# EAGLE design iot-plant-waterer (EAGLE 9.6.2)
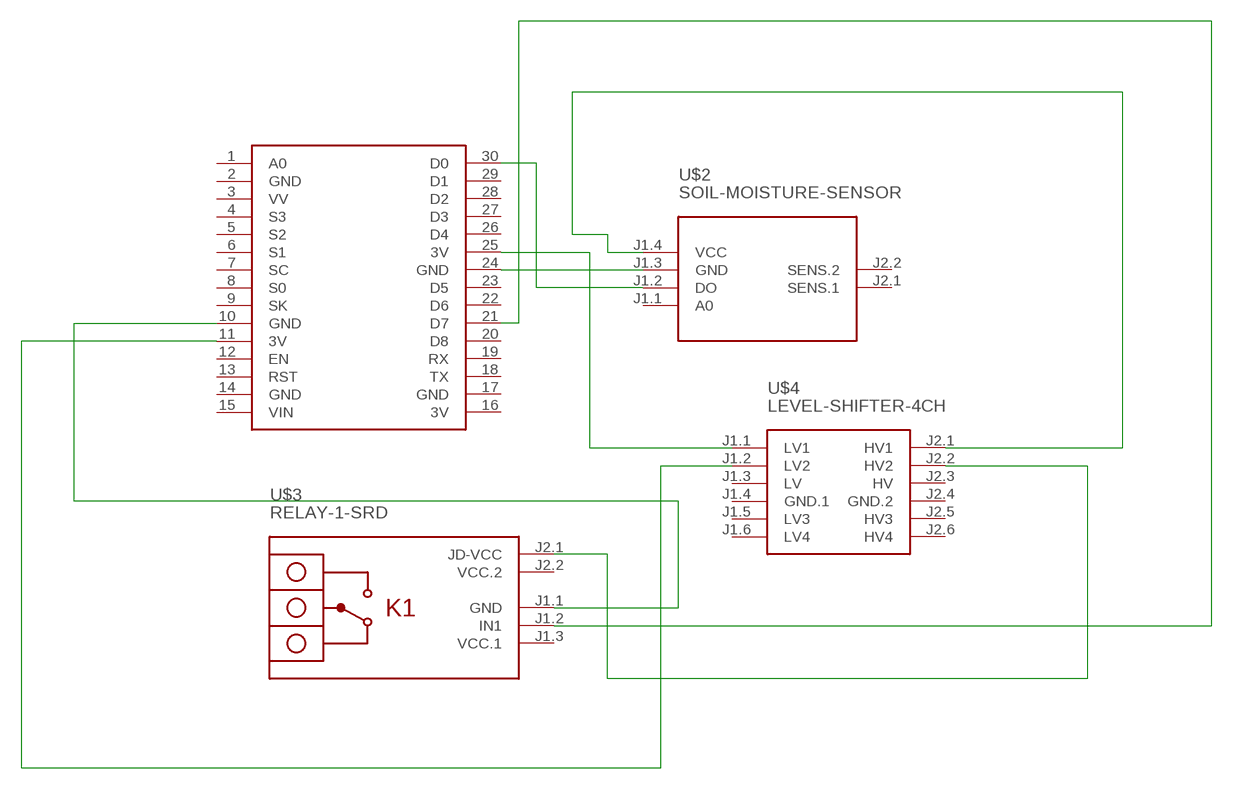
[diagram p0: schematic, sheet 1]

## Parts
U$1  NODEMCU  [NODEMCU]
U$2  SOIL-MOISTURE-SENSOR  [SOIL-MOISTURE-SENSOR]
U$3  RELAY-1-SRD  [RELAY-1-SRD]
U$4  LEVEL-SHIFTER-4CH  [LEVEL-SHIFTER-4CH]

## Nets
N$1: U$1.25(3V) U$4.J1.1(LV1)
N$2: U$2.J1.4(VCC) U$4.J2.1(HV1)
N$3: U$1.24(GND) U$2.J1.3(GND)
N$4: U$1.30(D0) U$2.J1.2(DO)
N$5: U$1.11(3V) U$4.J1.2(LV2)
N$6: U$3.J2.1(JD-VCC) U$4.J2.2(HV2)
N$7: U$1.10(GND) U$3.J1.1(GND)
N$8: U$1.21(D7) U$3.J1.2(IN1)
Unconnected: U$1.1(A0) U$1.3(VV) U$1.4(S3) U$1.5(S2) U$1.6(S1) U$1.7(SC) U$1.8(S0) U$1.9(SK) U$1.12(EN) U$1.13(RST) U$1.15(VIN) U$1.18(TX) U$1.19(RX) U$1.20(D8) U$1.22(D6) U$1.23(D5) U$1.26(D4) U$1.27(D3) U$1.28(D2) U$1.29(D1) U$2.J1.1(A0) U$2.J2.1(SENS.1) U$2.J2.2(SENS.2) U$4.J1.5(LV3) U$4.J1.6(LV4) U$4.J2.5(HV3) U$4.J2.6(HV4)

## Power pins joined to a net without a drawn wire
3V: U$1.16(3V)
GND: U$1.2(GND) U$1.14(GND) U$1.17(GND)
GND.1: U$4.J1.4(GND.1)
GND.2: U$4.J2.4(GND.2)
HV: U$4.J2.3(HV)
LV: U$4.J1.3(LV)
VCC.1: U$3.J1.3(VCC.1)
VCC.2: U$3.J2.2(VCC.2)

## Library data of the parts
U$1 = nodemcu:NODEMCU
U$2 = diy-modules:SOIL-MOISTURE-SENSOR: Soil Moisture Sensor Click here to find device on ebay.com <http://www.ebay.com/sch/soil+moisture+sensor+arduino>
U$3 = diy-modules:RELAY-1-SRD: 1-Channel Relay Module based on SRD-05VDC-SL-C relays Click here to find device on ebay.com <http://www.ebay.com/sch/one+channel+isolated+relay+5v>
U$4 = diy-modules:LEVEL-SHIFTER-4CH: 4-Channel Bi-Directional Logic Level Converter based on BSS128 transistors Click here to find device on ebay.com <http://www.ebay.com/sch/i2c+logic+converter+module>

## Board
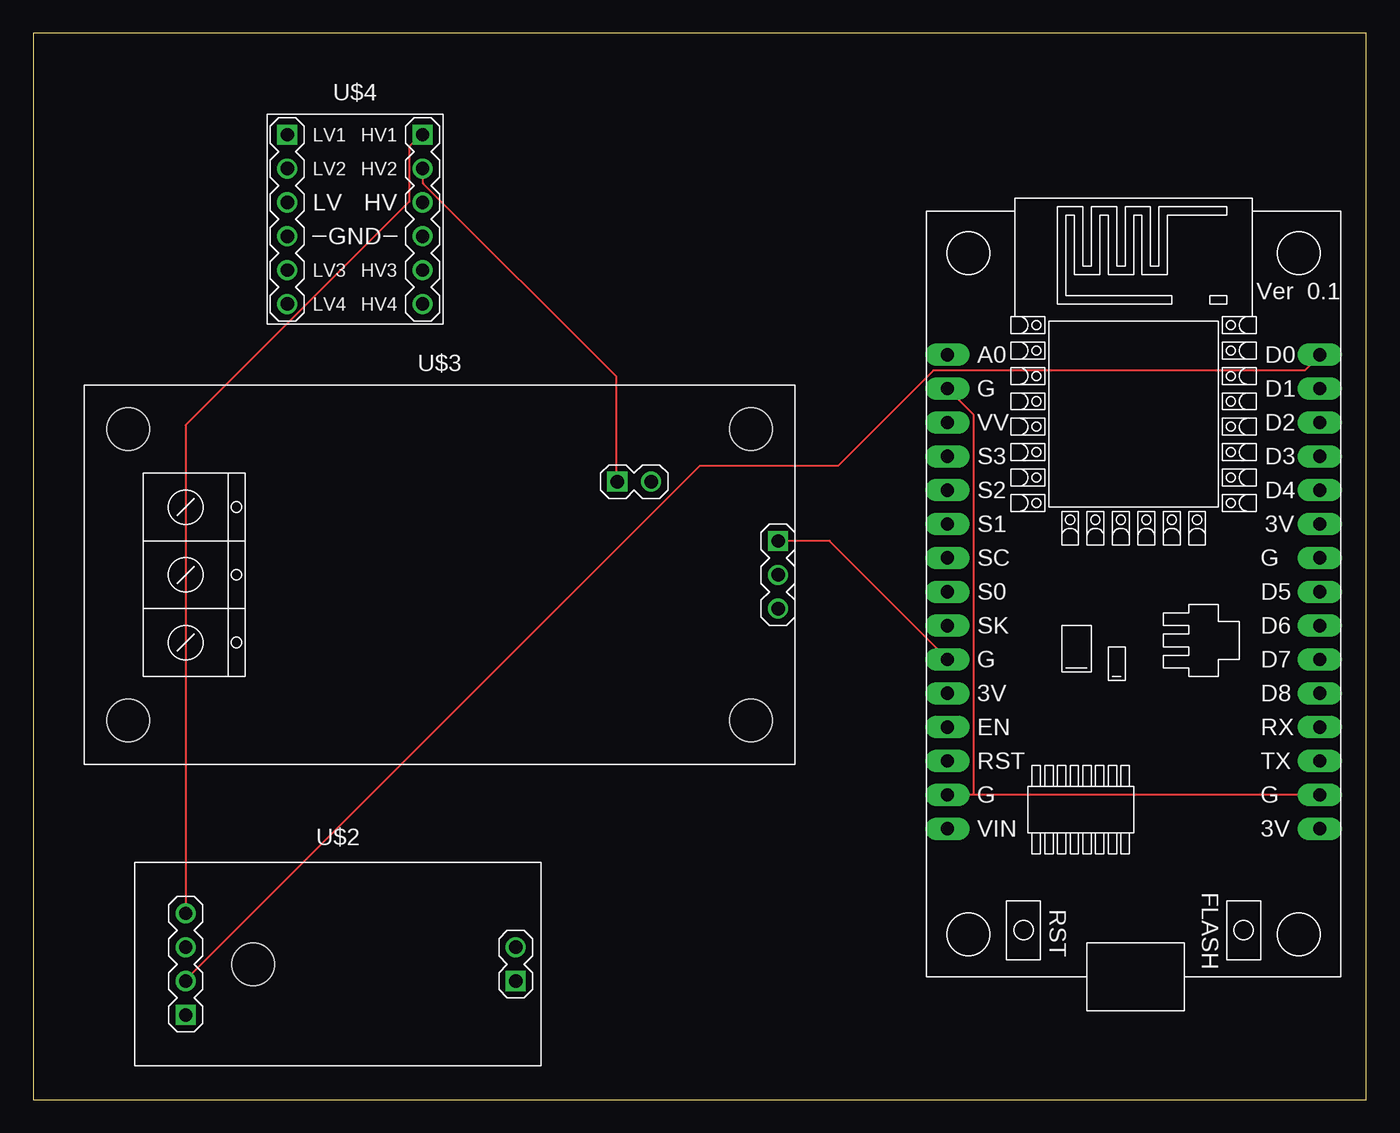
[diagram p1: board, top side]
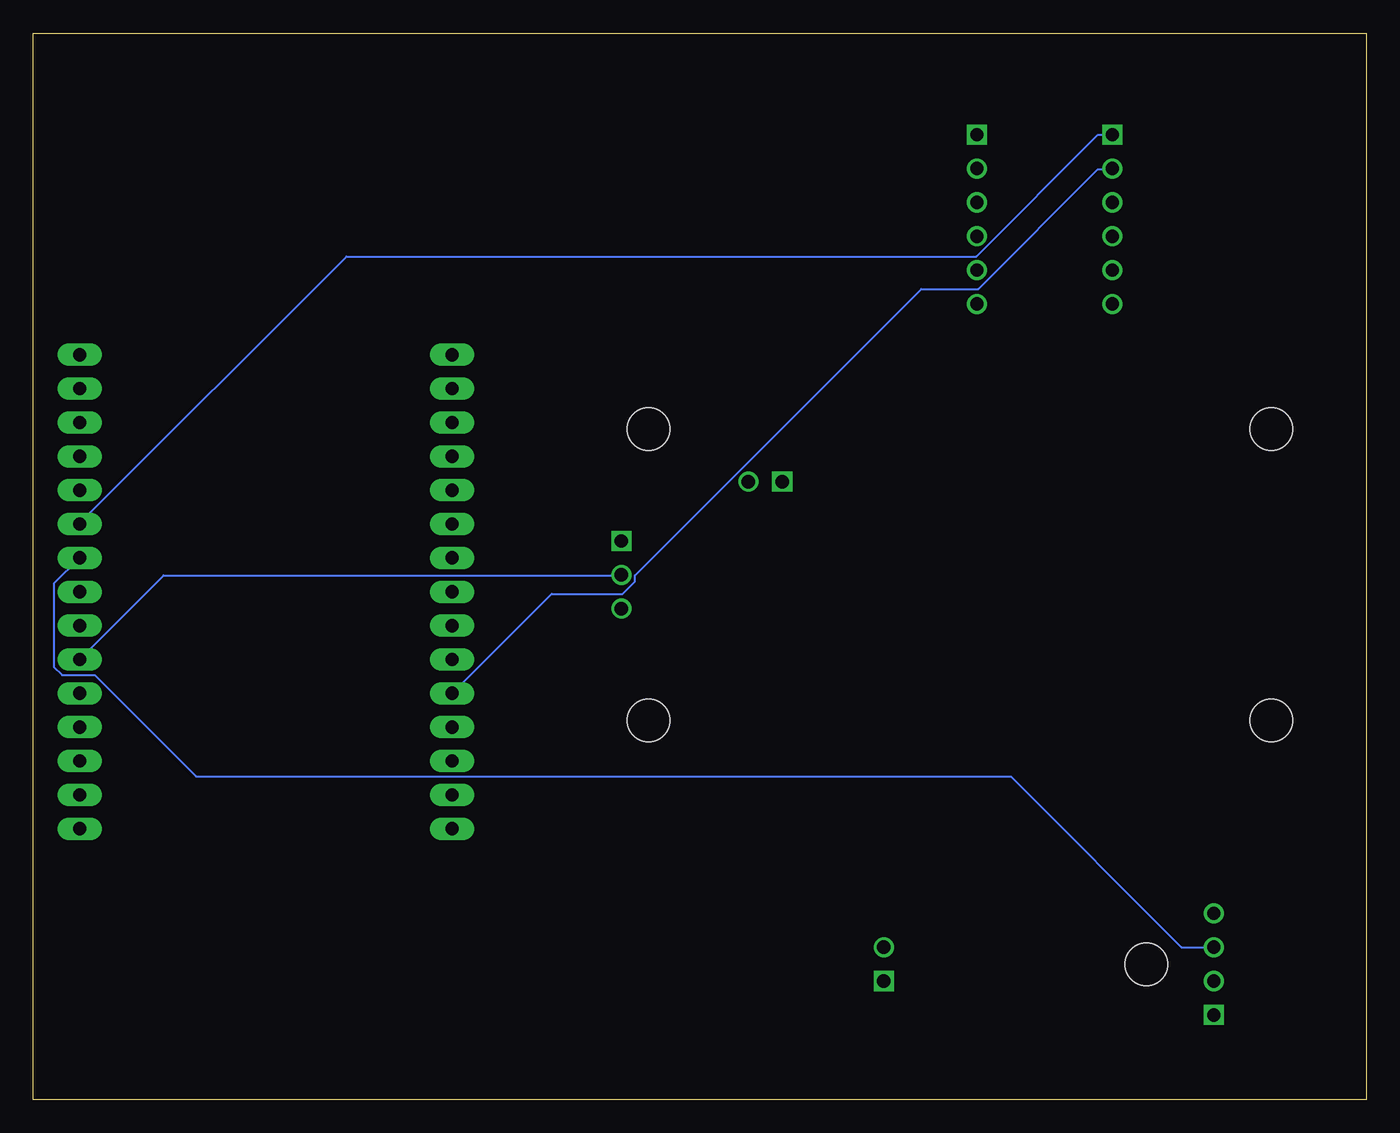
[diagram p2: board, bottom side, seen from below]

Size 100 x 80 mm. Coordinates in mm from the lower left corner, seen from the top.
Outline: 0,0 100,0 100,80 0,80 0,0
Copper layers (1*16): Top 0.035mm / dielectric 1.5mm / Bottom 0.035mm
Design rules "default": minimum track width 6mil, minimum drill 0.35mm, track to track 6mil, track to pad 6mil, pad to pad 6mil, via to via 6mil, smd to smd 6mil, copper to edge 40mil, drill to drill 6mil, minimum pad ring 10mil, minimum via ring 8mil, stop-mask expansion 4mil, vias tented up to drill 0mil, thermal gap 10mil

### Footprints (pad centres in the part's own frame; a part is rotated, then mirrored left to right if it is on the bottom)
NODEMCU = drill 1 pad 1.676 long: 1 -13.97,17.78; 2 -13.97,15.24; 3 -13.97,12.7; 4 -13.97,10.16; 5 -13.97,7.62; 6 -13.97,5.08; 7 -13.97,2.54; 8 -13.97,0; 9 -13.97,-2.54; 10 -13.97,-5.08; 11 -13.97,-7.62; 12 -13.97,-10.16; 13 -13.97,-12.7; 14 -13.97,-15.24; 15 -13.97,-17.78; 16 13.97,-17.78; 17 13.97,-15.24; 18 13.97,-12.7; 19 13.97,-10.16; 20 13.97,-7.62; 21 13.97,-5.08; 22 13.97,-2.54; 23 13.97,0; 24 13.97,2.54; 25 13.97,5.08; 26 13.97,7.62; 27 13.97,10.16; 28 13.97,12.7; 29 13.97,15.24; 30 13.97,17.78
SOIL-MOISTURE-SENSOR = drill 1 square: J1.1 -11.43,-3.81; J2.1 13.335,-1.27 | drill 1: J1.2 -11.43,-1.27; J1.3 -11.43,1.27; J1.4 -11.43,3.81; J2.2 13.335,1.27 | hole 3.2: -6.35,0
RELAY-1-SRD = drill 1 square: J1.1 25.4,2.54; J2.1 13.335,6.985 | drill 1: J1.2 25.4,0; J1.3 25.4,-2.54; J2.2 15.875,6.985 | hole 3.2: -23.368,10.922; 23.368,10.922; 23.368,-10.922; -23.368,-10.922
LEVEL-SHIFTER-4CH = drill 1 square: J1.1 -5.08,6.35; J2.1 5.08,6.35 | drill 1: J1.2 -5.08,3.81; J1.3 -5.08,1.27; J1.4 -5.08,-1.27; J1.5 -5.08,-3.81; J1.6 -5.08,-6.35; J2.2 5.08,3.81; J2.3 5.08,1.27; J2.4 5.08,-1.27; J2.5 5.08,-3.81; J2.6 5.08,-6.35

### Placement (x,y rotation side)
U$1  82.55,38.1 0 top
U$2  22.86,10.16 0 top
U$3  30.48,39.37 0 top
U$4  24.13,66.04 0 top

### Tracks (layer width: path | path; a pad name or v marks a point on that pad's centre or on a via)
GND
  Top 0.152: U$1.17 70.56,22.86 | 70.56,22.86 U$1.14 | U$1.2 70.56,51.36 70.56,22.86
N$1
  Bottom 0.152: U$4.J1.1 20.12,72.39 29.26,63.25 76.5,63.25 96.47,43.28 U$1.25
N$2
  Top 0.152: U$2.J1.4 11.43,50.6 28.19,67.36 28.19,71.48 29.11,72.39 U$4.J2.1
N$3
  Bottom 0.152: U$2.J1.3 13.87,11.43 26.67,24.23 87.78,24.23 95.4,31.85 97.84,31.85 98.45,32.46 98.45,38.71 U$1.24
N$4
  Top 0.152: U$2.J1.2 11.43,8.99 49.99,47.55 60.35,47.55 67.51,54.71 95.4,54.71 96.47,55.78 U$1.30
N$5
  Bottom 0.152: U$1.11 61.11,37.95 55.78,37.95 54.86,38.86 54.86,39.32 33.38,60.81 29.11,60.81 20.12,69.8 19.05,69.8 U$4.J1.2
N$6
  Top 0.152: U$4.J2.2 29.26,69.8 29.26,68.73 43.74,54.25 43.74,46.48 U$3.J2.1
N$7
  Top 0.152: U$3.J1.1 59.74,41.91 68.58,33.07 U$1.10
N$8
  Bottom 0.152: U$1.21 90.22,39.32 55.93,39.32 U$3.J1.2